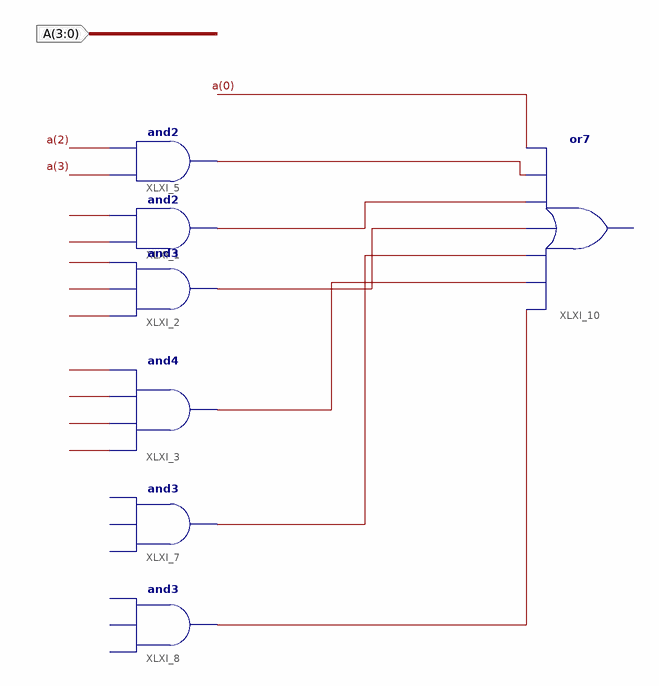
[diagram p0: schematic sheet 1]
// Xilinx ISE schematic main.sch (spartan3e) as structural Verilog: 7 symbols, 1 ports
module main (
  input  [3:0] A
);

  wire XLXN_2, XLXN_3, XLXN_8, XLXN_11, XLXN_14, XLXN_16, XLXN_22, XLXN_23, XLXN_24, XLXN_25, XLXN_26,
       XLXN_27, XLXN_28, XLXN_29, XLXN_30;

  and XLXI_1 (XLXN_3, XLXN_23, XLXN_22);
  and XLXI_2 (XLXN_14, XLXN_26, XLXN_25, XLXN_24);
  and XLXI_3 (XLXN_16, XLXN_30, XLXN_29, XLXN_28, XLXN_27);
  and XLXI_5 (XLXN_2, A[3], A[2]);
  // and3 XLXI_7 has open pins: I0=open, I1=open, I2=open, O=XLXN_11
  // and3 XLXI_8 has open pins: I0=open, I1=open, I2=open, O=XLXN_8
  // or7 XLXI_10 has open pins: I0=XLXN_8, I1=XLXN_16, I2=XLXN_11, I3=XLXN_14, I4=XLXN_3, I5=XLXN_2, I6=A[0], O=open
endmodule
